# EAGLE design OpenSourceSyringePump (EAGLE 9.3.2)
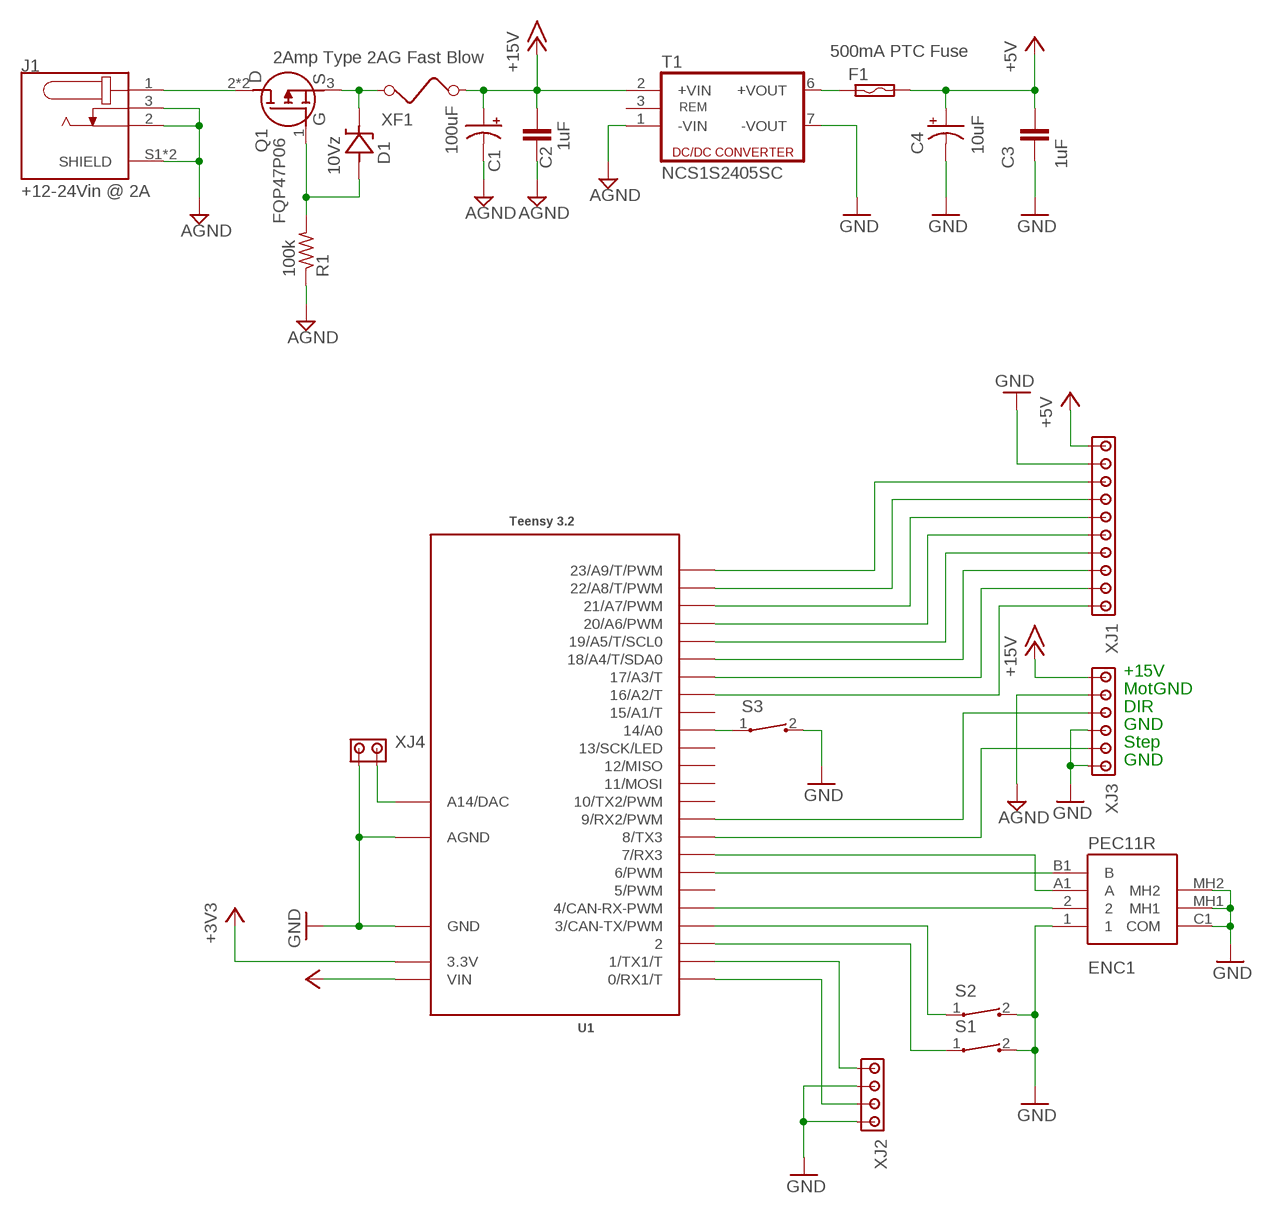
[diagram p0: schematic, sheet 1]

## Parts
C1  100uF  EEUFR1H101  [EEUFR1H101]
C2  1uF  K105Z20Y5VF5TL2  [K105Z20Y5VF5TL2]
C3  1uF  K105Z20Y5VF5TL2  [K105Z20Y5VF5TL2]
C4  10uF  TAP106K025SCS  [TAP106K025SCS]
D1  10Vz  BZX79C10  [BZX79C10]
ENC1  PEC11R  PEC11R-4220F-S0024  [PEC11R4220FS0024]
F1  500mA PTC Fuse  BOURNS-MF-R025  [BOURNS-MF-R025]
J1  +12-24Vin @ 2A  PJ-079AH  [CUI_PJ-079AH]
Q1  FQP47P06  [FQP47P06]
R1  100k  RESISTOR.25W  [0204/7]
S1  ALPS-SKRGAFD010  [ALPS-SKRGAFD010]
S2  ALPS-SKRGAFD010  [ALPS-SKRGAFD010]
S3  ALPS-SKRGAFD010  [ALPS-SKRGAFD010]
T1  NCS1S2405SC  MURATA-NCS1S2405SC  [MURATA-NCS1S2405SC]
U1  Teensy 3.2  TEENSY_3.1-3.2_OUTER_ROW  [TEENSY_3.0-3.2&LC_OUTER_ROW]
XF1  2Amp Type 2AG Fast Blow  LITTLEFUSE-02540101Z  [LITTLEFUSE-02540101Z]
XJ1  TE-1-282834-0-DOUBLE  [TE-1-282834-0-DOUBLE]
XJ2  TE-282834-4-DOUBLE  [TE-282834-4-DOUBLE]
XJ3  TE-282834-6-DOUBLE  [TE-282834-6-DOUBLE]
XJ4  TE-282834-2-DOUBLE  [TE-282834-2-DOUBLE]

## Nets
+3V3: U1.3.3V
+5V: C3.1 C4.+ F1.2 U1.VIN XJ1.1 XJ1.P$1
+15V: C1.+ C2.1 T1.2(+VIN) XF1.1 XJ3.1 XJ3.P$1
GND: C3.2 C4.- ENC1.1 ENC1.C1(COM) ENC1.MH1 ENC1.MH2 S1.2 S2.2 S3.2 T1.7(-VOUT) U1.AGND U1.GND XJ1.2 XJ1.P$2 XJ2.2 XJ2.4 XJ2.P$2 XJ2.P$4 XJ3.4 XJ3.6 XJ3.P$4 XJ3.P$6 XJ4.1 XJ4.P$1
MGND: C1.- C2.2 J1.2 J1.3 J1.S1(SHIELD) J1.S2(SHIELD) R1.1 T1.1(-VIN) XJ3.2 XJ3.P$2 ; supply symbol labelled AGND
N$1: J1.1 Q1.2(D) Q1.MH(D)
N$2: D1.A Q1.1(G) R1.2
N$3: F1.1 T1.6(+VOUT)
N$4: D1.C Q1.3(S) XF1.2
N$5: ENC1.B1(B) U1.6(6/PWM)
N$6: ENC1.A1(A) U1.7(7/RX3)
N$7: U1.0(0/RX1/T) XJ2.3 XJ2.P$3
N$8: U1.1(1/TX1/T) XJ2.1 XJ2.P$1
N$9: S2.1 U1.3(3/CAN-TX/PWM)
N$10: ENC1.2 U1.4(4/CAN-RX-PWM)
N$11: S3.1 U1.14/A0
N$12: U1.8(8/TX3) XJ3.5 XJ3.P$5
N$13: U1.9(9/RX2/PWM) XJ3.3 XJ3.P$3
N$14: U1.16/A2(16/A2/T) XJ1.10 XJ1.P$10
N$15: U1.17/A3(17/A3/T) XJ1.9 XJ1.P$9
N$16: U1.18/A4(18/A4/T/SDA0) XJ1.8 XJ1.P$8
N$17: U1.19/A5(19/A5/T/SCL0) XJ1.7 XJ1.P$7
N$18: U1.20/A6(20/A6/PWM) XJ1.6 XJ1.P$6
N$19: U1.21/A7(21/A7/PWM) XJ1.5 XJ1.P$5
N$20: U1.22/A8(22/A8/T/PWM) XJ1.4 XJ1.P$4
N$21: U1.23/A9(23/A9/T/PWM) XJ1.3 XJ1.P$3
N$22: S1.1 U1.2
N$23: U1.RESET/DAC(A14/DAC) XJ4.2 XJ4.P$2
Unconnected: T1.3(REM) U1.5(5/PWM) U1.10(10/TX2/PWM) U1.11(11/MOSI) U1.12(12/MISO) U1.13(13/SCK/LED) U1.15/A1(15/A1/T)

## Notes on the sheet
- +15V
- MotGND
- DIR
- GND
- Step
- GND

## Library data of the parts
C1 = OpenSourceSyringePump:EEUFR1H101
C2 C3 = OpenSourceSyringePump:K105Z20Y5VF5TL2
C4 = OpenSourceSyringePump:TAP106K025SCS
D1 = OpenSourceSyringePump:BZX79C10
ENC1 = OpenSourceSyringePump:PEC11R-4220F-S0024: Bourns 24 Pulse Incremental Mechanical Rotary Encoder with a 6 mm Flat Shaft (Not Indexed), Through Hole Source: Datasheet <https://componentsearchengine.com/Datasheets/1/PEC11R-4220F-S0024.pdf>; DESCRIPTION: Bourns 24 Pulse Incremental Mechanical Rotary Encoder with a 6 mm Flat Shaft (Not Indexed), Through Hole; HEIGHT: 27.5mm; MANUFACTURER_NAME: Bourns; MANUFACTURER_PART_NUMBER: PEC11R-4220F-S0024; MOUSER_PART_NUMBER: 652-PEC11R-4220F-S24; MOUSER_PRICE-STOCK: https://www.mouser.com/Search/Refine.aspx?Keyword=652-PEC11R-4220F-S24
F1 = OpenSourceSyringePump:BOURNS-MF-R025
J1 = OpenSourceSyringePump:PJ-079AH: DC Power Jack • 2 mm center pin • 5 A rating • shielded • through hole • 1 switch; MANUFACTURER: CUI Inc; PARTREV: LTR; STANDART: Manufacturer Recommendations
Q1 = OpenSourceSyringePump:FQP47P06
R1 = OpenSourceSyringePump:RESISTOR.25W
S1-S3 = OpenSourceSyringePump:ALPS-SKRGAFD010
T1 = OpenSourceSyringePump:MURATA-NCS1S2405SC
U1 = OpenSourceSyringePump:TEENSY_3.1-3.2_OUTER_ROW: Footprint for Teensy 3.1 or 3.2 board using all pin connections on the outer perimeter
XF1 = OpenSourceSyringePump:LITTLEFUSE-02540101Z
XJ1 = OpenSourceSyringePump:TE-1-282834-0-DOUBLE
XJ2 = OpenSourceSyringePump:TE-282834-4-DOUBLE
XJ3 = OpenSourceSyringePump:TE-282834-6-DOUBLE
XJ4 = OpenSourceSyringePump:TE-282834-2-DOUBLE

## Board
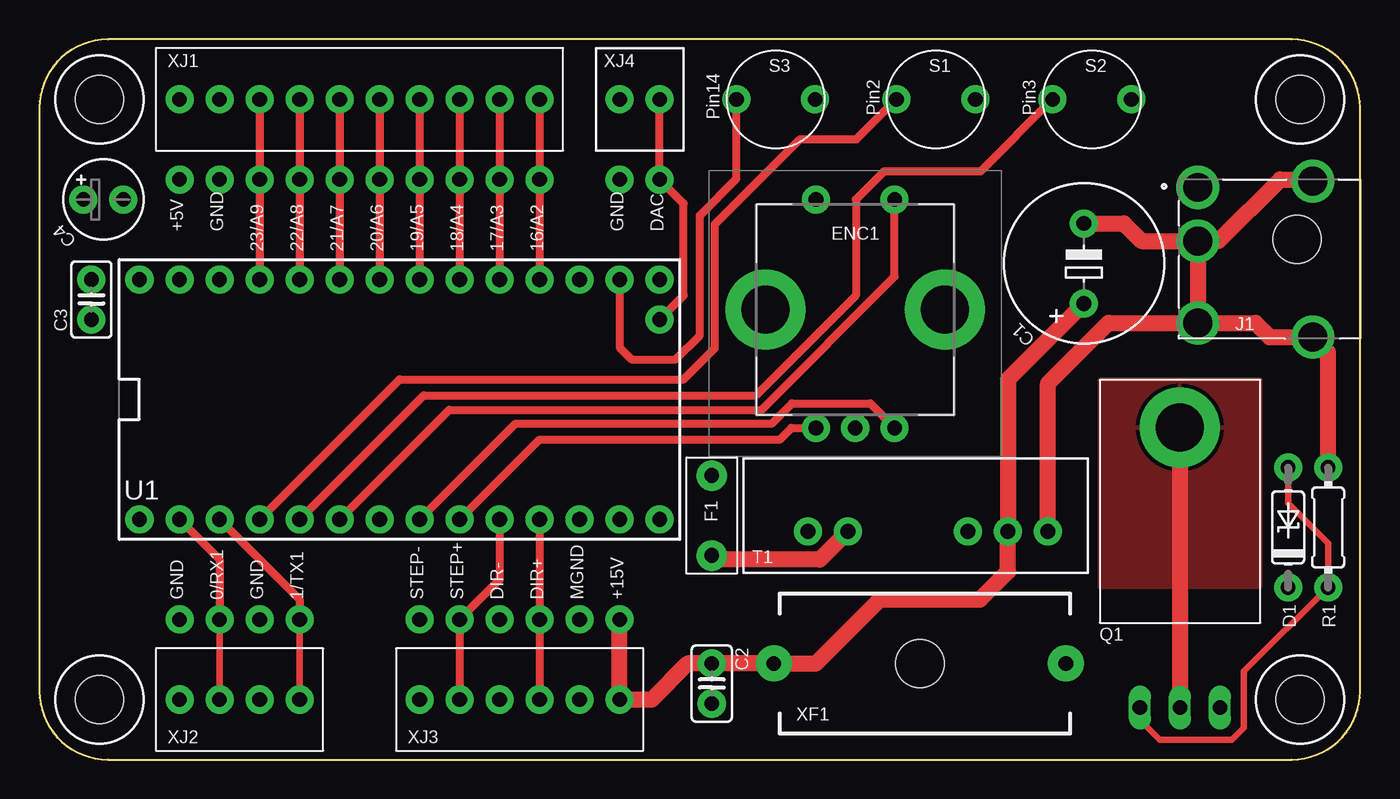
[diagram p1: board, top side]
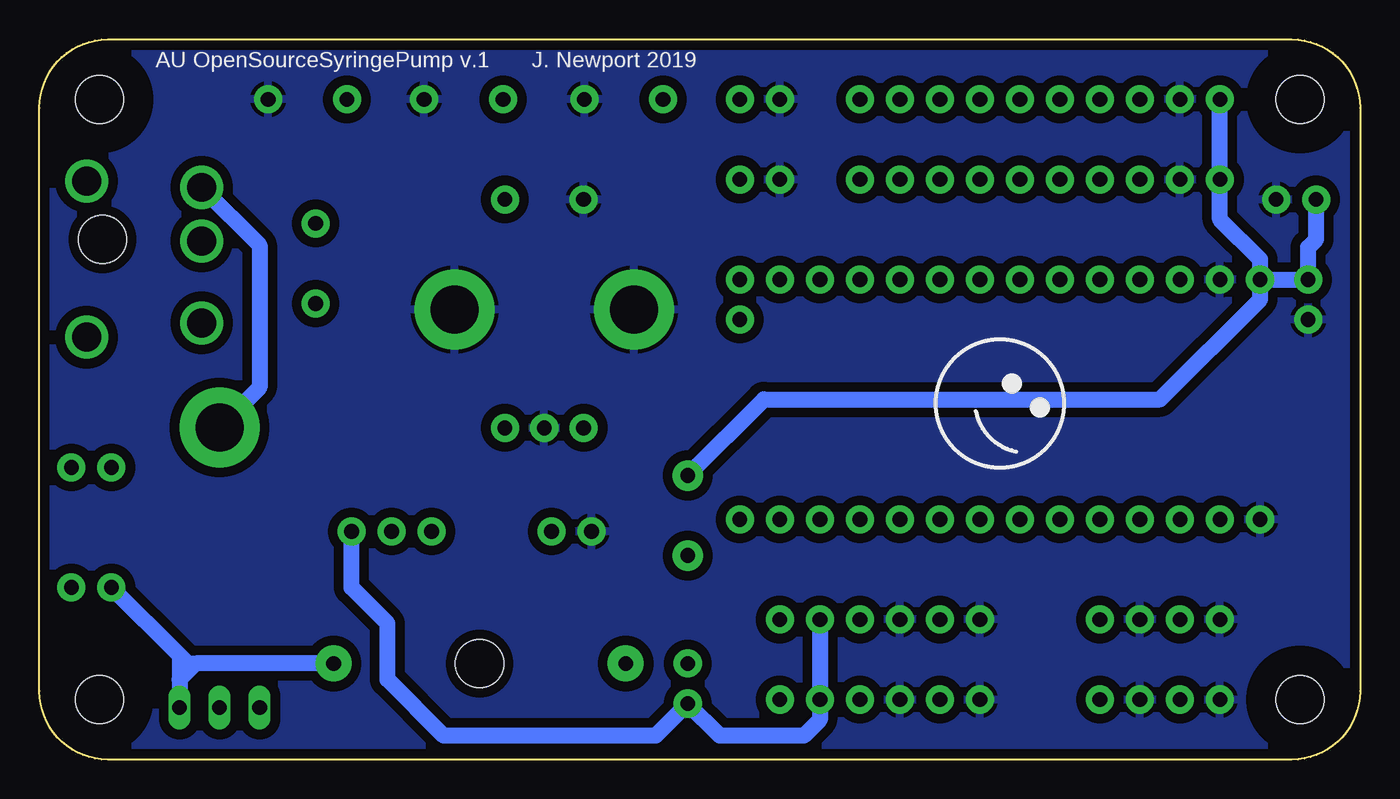
[diagram p2: board, bottom side, seen from below]

Size 83.82 x 45.72 mm. Coordinates in mm from the lower left corner, seen from the top.
Outline: 0,41.38 0,4.34 arc90 4.34,0 79.48,0 arc90 83.82,4.34 83.82,41.38 arc90 79.48,45.72 4.34,45.72 arc90 0,41.38
Copper layers (1*16): Top 0.035559375mm / dielectric 1.6mm / Bottom 0.035559375mm
Design rules "oshpark-2layer": minimum track width 6mil, minimum drill 10mil, track to track 6mil, track to pad 6mil, pad to pad 6mil, via to via 6mil, smd to smd 6mil, copper to edge 15mil, drill to drill 6mil, minimum pad ring 5mil, minimum via ring 5mil, stop-mask expansion 2.5mil, vias tented up to drill 0mil, thermal gap 10mil
Holes 3.05 mm at 3.81,3.81 3.81,41.91 80.01,41.91 80.01,3.81
bRestrict: area 2.3,40.4 to 5.3,43.4; area 2.3,2.3 to 5.3,5.3; area 78.5,40.4 to 81.5,43.4; area 78.5,2.3 to 81.5,5.3

### Footprints (pad centres in the part's own frame; a part is rotated, then mirrored left to right if it is on the bottom)
EEUFR1H101 = drill 0.94 pad 1.778: + -2.54,0; - 2.54,0
K105Z20Y5VF5TL2 = drill 0.94 pad 1.778: 1 -1.27,0; 2 1.27,0
TAP106K025SCS = drill 0.94 pad 1.778: + -1.27,0; - 1.27,0
BZX79C10 = drill 0.94 pad 1.778: A 3.81,0; C -3.81,0
PEC11R4220FS0024 = drill 0.94 pad 1.778: 1 0,0; 2 5,0; A1 0,-14.5; B1 5,-14.5; C1 2.5,-14.5 | drill 3.048 pad 5.08: MH1 -3.2,-7; MH2 8.2,-7
BOURNS-MF-R025 = drill 0.94 pad 1.93: 1 -2.54,0; 2 2.54,0
CUI_PJ-079AH = drill 1.829: 1 10.3,-3.3; 2 10.3,5.3; 3 10.3,0.1; S1 3,6.2; S2 3,-3.7 | hole 3.048: 4,0
FQP47P06 = drill 0.94 long: 1 -2.54,-17.78; 2 0,-17.78; 3 2.54,-17.78 | drill 3.048 pad 5.08: MH 0,0
0204/7 = drill 0.94 pad 1.778: 1 -3.81,0; 2 3.81,0
ALPS-SKRGAFD010 = drill 0.94 pad 1.778: 1 -2.5,0; 2 2.5,0
MURATA-NCS1S2405SC = drill 0.94 pad 1.778: 1 0,0; 2 2.54,0; 3 5.08,0; 6 12.7,0; 7 15.24,0
TEENSY_3.0-3.2&LC_OUTER_ROW = drill 0.94 pad 1.778: 0 -7.62,13.97; 1 -7.62,11.43; 2 -7.62,8.89; 3 -7.62,6.35; 3.3V 7.62,11.43; 4 -7.62,3.81; 5 -7.62,1.27; 6 -7.62,-1.27; 7 -7.62,-3.81; 8 -7.62,-6.35; 9 -7.62,-8.89; 10 -7.62,-11.43; 11 -7.62,-13.97; 12 -7.62,-16.51; 13 7.62,-16.51; 14/A0 7.62,-13.97; 15/A1 7.62,-11.43; 16/A2 7.62,-8.89; 17/A3 7.62,-6.35; 18/A4 7.62,-3.81; 19/A5 7.62,-1.27; 20/A6 7.62,1.27; 21/A7 7.62,3.81; 22/A8 7.62,6.35; 23/A9 7.62,8.89; AGND 7.62,13.97; GND -7.62,16.51; RESET/DAC 5.08,-16.51; VIN 7.62,16.51
LITTLEFUSE-02540101Z = drill 0.94 pad 2.286: 1 -9.271,0; 2 9.271,0 | hole 3.048: 0,0
TE-1-282834-0-DOUBLE = drill 0.94 pad 1.778: 1 -11.43,0; 2 -8.89,0; 3 -6.35,0; 4 -3.81,0; 5 -1.27,0; 6 1.27,0; 7 3.81,0; 8 6.35,0; 9 8.89,0; 10 11.43,0; P$1 -11.43,-5.08; P$2 -8.89,-5.08; P$3 -6.35,-5.08; P$4 -3.81,-5.08; P$5 -1.27,-5.08; P$6 1.27,-5.08; P$7 3.81,-5.08; P$8 6.35,-5.08; P$9 8.89,-5.08; P$10 11.43,-5.08
TE-282834-4-DOUBLE = drill 0.94 pad 1.778: 1 -3.81,0; 2 -1.27,0; 3 1.27,0; 4 3.81,0; P$1 -3.81,-5.08; P$2 -1.27,-5.08; P$3 1.27,-5.08; P$4 3.81,-5.08
TE-282834-6-DOUBLE = drill 0.94 pad 1.778: 1 -6.35,0; 2 -3.81,0; 3 -1.27,0; 4 1.27,0; 5 3.81,0; 6 6.35,0; P$1 -6.35,-5.08; P$2 -3.81,-5.08; P$3 -1.27,-5.08; P$4 1.27,-5.08; P$5 3.81,-5.08; P$6 6.35,-5.08
TE-282834-2-DOUBLE = drill 0.94 pad 1.778: 1 -1.27,0; 2 1.27,0; P$1 -1.27,-5.08; P$2 1.27,-5.08

### Placement (x,y rotation side)
C1  66.29,31.5 90 top
C2  42.67,4.83 270 top
C3  3.3,29.21 270 top
C4  4.06,35.56 0 top
D1  79.25,14.73 90 top
ENC1  49.28,35.56 0 top
F1  42.67,15.49 90 top
J1  83.82,33.02 180 top
Q1  72.39,21.08 0 top
R1  81.79,14.73 270 top
S1  56.9,41.91 0 top
S2  66.8,41.91 0 top
S3  46.74,41.91 0 top
T1  64.01,14.48 180 top
U1  22.86,22.86 90 top
XF1  55.88,6.1 0 top
XJ1  20.32,41.91 0 top
XJ2  12.7,3.81 180 top
XJ3  30.48,3.81 180 top
XJ4  38.1,41.91 0 top

### Tracks (layer width: path | path; a pad name or v marks a point on that pad's centre or on a via)
+5V
  Bottom 1.016: F1.2 37.85,22.86 12.7,22.86 6.35,29.21 U1.VIN | U1.VIN C3.1 3.3,32.51 2.79,33.02 C4.+ | U1.VIN 6.35,31.75 8.89,34.29 XJ1.P$1 XJ1.1
+15V
  Top 1.016: C1.+ 61.47,24.13 T1.2 61.47,11.94 59.69,10.16 53.34,10.16 49.28,6.1 XF1.1 C2.1 41.15,6.1 38.86,3.81 XJ3.1 XJ3.P$1
GND
  pour Bottom (isolate 0.61): 0,0 0,45.72 83.82,45.72 83.82,0
MGND
  Top 1.016: T1.1 64.01,23.88 67.85,27.72 J1.2 | C1.- 68.83,34.04 69.95,32.92 J1.3 | J1.3 J1.2 | J1.2 77.18,27.72 78.08,26.82 J1.S1 81.79,25.85 R1.1 | J1.3 74.83,32.92 78.74,36.83 80.71,36.83 J1.S2
  Bottom 1.016: XJ3.P$2 XJ3.2 34.29,2.54 35.31,1.52 40.64,1.52 C2.2 44.7,1.52 58.17,1.52 61.72,5.08 61.72,8.64 64.01,10.92 T1.1
N$1
  Top 1.016: Q1.MH Q1.2
  Bottom 1.016: J1.1 69.85,32.65 69.85,23.62 Q1.MH
  pour Top (isolate 0.406): 67.31,10.92 67.31,24.13 77.47,24.13 77.47,10.92
N$2
  Top 0.406: D1.A 79.25,16.26 81.79,13.72 R1.2 76.45,5.59 76.45,2.03 75.69,1.27 71.12,1.27 69.85,2.54 Q1.1
N$3
  Top 1.016: T1.6 49.53,12.7 42.93,12.7 F1.1
N$4
  Bottom 1.016: XF1.2 73.91,6.1 | 73.91,6.1 74.93,5.08 Q1.3 74.93,6.6 | D1.C 74.93,6.6 | 74.93,6.6 74.42,6.1 73.91,6.1
N$5
  Top 0.508: U1.6 30.23,21.34 46.48,21.34 47.75,22.61 52.73,22.61 ENC1.B1
N$6
  Top 0.508: U1.7 31.75,20.32 46.99,20.32 47.73,21.06 ENC1.A1
N$7
  Top 0.406: XJ2.P$3 XJ2.3
  Top 0.508: U1.0 11.43,12.7 XJ2.P$3
N$8
  Top 0.406: XJ2.P$1 XJ2.1
  Top 0.508: U1.1 16.51,10.16 XJ2.P$1
N$9
  Top 0.508: U1.3 24.38,23.11 45.47,23.11 51.82,29.46 51.82,35.56 53.59,37.34 59.73,37.34 S2.1
N$10
  Top 0.508: U1.4 26.01,22.2 45.82,22.2 54.28,30.65 ENC1.2
N$11
  Top 0.508: S3.1 44.24,36.87 41.91,34.54 41.91,26.92 40.39,25.4 37.59,25.4 36.83,26.16 U1.14/A0
N$12
  Top 0.508: U1.8 29.21,11.43 XJ3.P$5 XJ3.5
N$13
  Top 0.508: U1.9 XJ3.P$3 XJ3.3
N$14
  Top 0.508: XJ1.10 XJ1.P$10 U1.16/A2
N$15
  Top 0.508: XJ1.9 XJ1.P$9 U1.17/A3
N$16
  Top 0.508: XJ1.8 XJ1.P$8 U1.18/A4
N$17
  Top 0.508: XJ1.7 XJ1.P$7 U1.19/A5
N$18
  Top 0.508: XJ1.6 XJ1.P$6 U1.20/A6
N$19
  Top 0.508: XJ1.5 XJ1.P$5 U1.21/A7
N$20
  Top 0.508: XJ1.4 XJ1.P$4 U1.22/A8
N$21
  Top 0.508: XJ1.3 XJ1.P$3 U1.23/A9
N$22
  Top 0.508: U1.2 22.86,24.13 40.89,24.13 42.88,26.11 42.88,33.99 48.26,39.37 51.86,39.37 S1.1
N$23
  Top 0.508: U1.RESET/DAC 40.89,29.46 40.89,35.31 XJ4.P$2 XJ4.2

### Text on the board
tPlace: Pin14 | Pin2 | Pin3 | +5V | GND | GND | DAC | 23/A9 | 22/A8 | 21/A7 | 20/A6 | 19/A5 | 18/A4 | 17/A3 | 16/A2 | GND | 0/RX1 | GND | 1/TX1 | STEP- | STEP+ | DIR- | DIR+ | MGND | +15V
bPlace: J. Newport 2019 | AU OpenSourceSyringePump v.1